# EAGLE design SimpleCART (EAGLE 9.6.2)
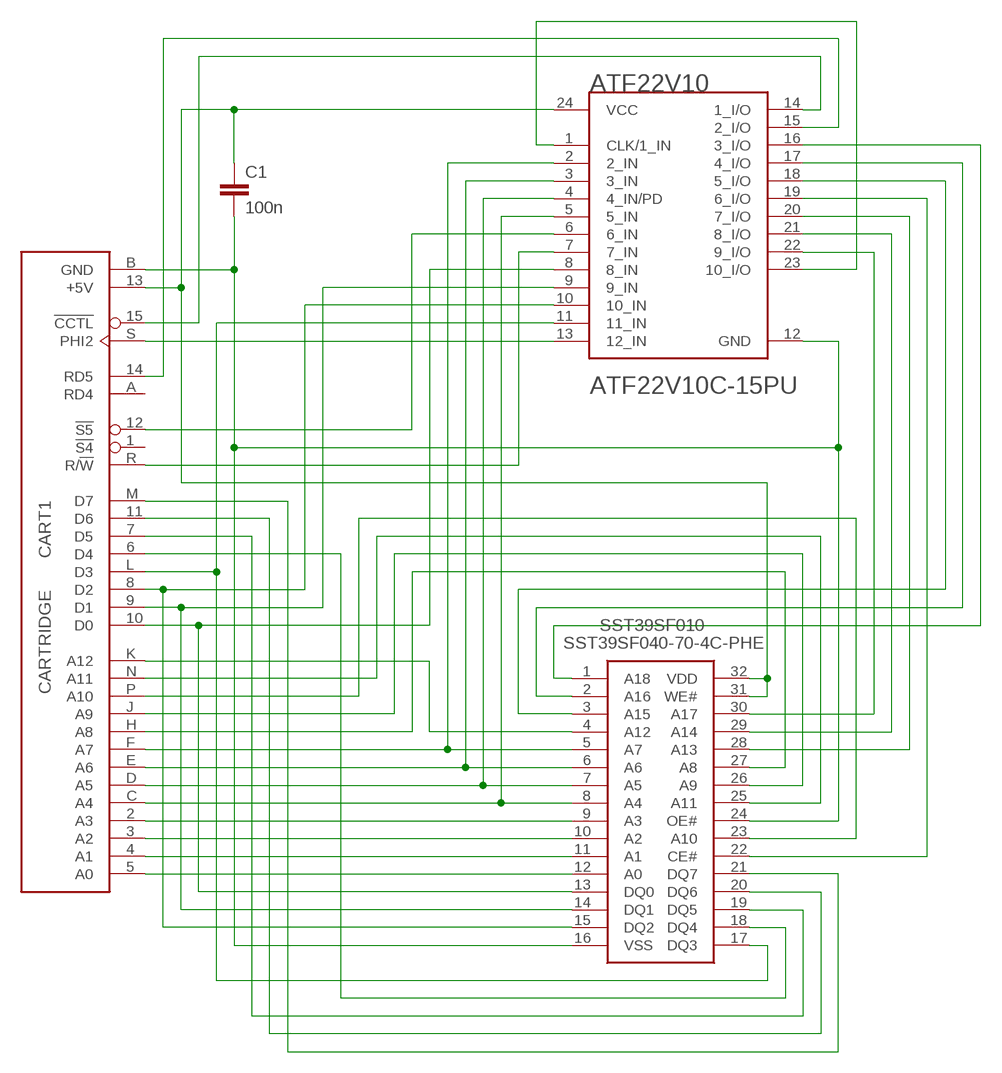
[diagram p0: schematic, sheet 1]

## Parts
ATF22V10  MICROCHIP_ATF22V10C-15PUMICROCHIP_ATF22V10C-15PU_0_0  [MICROCHIP_ATF22V10C-15PU_0]
C1  100n  C-EU025-024X044  [C025-024X044]
CART1  CARTRIDGE  [CARTRIDGE]
SST39SF010  SST39SF040-70-4C-PHE  [DIP1556W56P254L4191H508Q32N]

## Nets
A0: CART1.5(A0) SST39SF010.12(A0)
A1: CART1.4(A1) SST39SF010.11(A1)
A2: CART1.3(A2) SST39SF010.10(A2)
A3: CART1.2(A3) SST39SF010.9(A3)
A4: ATF22V10.5(5_IN) CART1.C(A4) SST39SF010.8(A4)
A5: ATF22V10.4(4_IN/PD) CART1.D(A5) SST39SF010.7(A5)
A6: ATF22V10.3(3_IN) CART1.E(A6) SST39SF010.6(A6)
A7: ATF22V10.2(2_IN) CART1.F(A7) SST39SF010.5(A7)
A8: CART1.H(A8) SST39SF010.27(A8)
A9: CART1.J(A9) SST39SF010.26(A9)
A10: CART1.P(A10) SST39SF010.23(A10)
A11: CART1.N(A11) SST39SF010.25(A11)
A12: CART1.K(A12) SST39SF010.4(A12)
A13: ATF22V10.20(7_I/O) SST39SF010.28(A13)
A14: ATF22V10.21(8_I/O) SST39SF010.29(A14)
A15: ATF22V10.18(5_I/O) SST39SF010.3(A15)
A16: ATF22V10.17(4_I/O) SST39SF010.2(A16)
A17: ATF22V10.22(9_I/O) SST39SF010.30(A17)
A18: ATF22V10.16(3_I/O) SST39SF010.1(A18)
CCTL: ATF22V10.14(1_I/O) CART1.15(!CCTL)
CE: ATF22V10.19(6_I/O) SST39SF010.22(CE#)
CLK: ATF22V10.1(CLK/1_IN) ATF22V10.23(10_I/O)
D0: ATF22V10.8(8_IN) CART1.10(D0) SST39SF010.13(DQ0)
D1: ATF22V10.9(9_IN) CART1.9(D1) SST39SF010.14(DQ1)
D2: ATF22V10.10(10_IN) CART1.8(D2) SST39SF010.15(DQ2)
D3: ATF22V10.11(11_IN) CART1.L(D3) SST39SF010.17(DQ3)
D4: CART1.6(D4) SST39SF010.18(DQ4)
D5: CART1.7(D5) SST39SF010.19(DQ5)
D6: CART1.11(D6) SST39SF010.20(DQ6)
D7: CART1.M(D7) SST39SF010.21(DQ7)
GND: ATF22V10.12(GND) C1.2 CART1.B(GND) SST39SF010.16(VSS) SST39SF010.24(OE#)
PHI2: ATF22V10.13(12_IN) CART1.S(PHI2)
RD5: ATF22V10.15(2_I/O) CART1.14(RD5)
RW: ATF22V10.7(7_IN) CART1.R(R/!W)
S5: ATF22V10.6(6_IN) CART1.12(!S5)
VCC: ATF22V10.24(VCC) C1.1 CART1.13(+5V) SST39SF010.31(WE#) SST39SF010.32(VDD)
Unconnected: CART1.1(!S4) CART1.A(RD4)

## Library data of the parts
ATF22V10 = Microchip - ATF22V10C-15PU:MICROCHIP_ATF22V10C-15PU: IC PLD 10MC 15NS 24DIP; AMBIENT_TEMPERATURE_RANGE_HIGH: +85°C; AMBIENT_TEMPERATURE_RANGE_LOW: -40°C; AUTOMOTIVE: No; CENTROID_NOT_SPECIFIED: No; DATASHEET: http://ww1.microchip.com/downloads/en/DeviceDoc/doc0735.pdf; DEVICE_CLASS_L1: Integrated Circuits (ICs); DEVICE_CLASS_L2: Embedded Processors and Controllers; DEVICE_CLASS_L3: CPLDs - Complex Programming Logic Devices; DIGIKEY_DESCRIPTION: IC PLD 10MC 15NS 24DIP; DIGIKEY_PART_NUMBER: ATF22V10C-15PU-ND; FOOTPRINT_PARAMETERS_0: {"fp_type":"DIP","params":{"N":{"nom":24,"long name":"Number of leads","min":null,"max":null,"short name":"N","type":"count"},"A":{"nom":false,"long name":"Height","min":false,"max":5334000,"short name":"A","type":"measurement"},"A1":{"nom":false,"long name":"Package clearance","min":381000,"max":false,"short name":"A1","type":"measurement"},"A2":{"nom":false,"long name":"Package height","min":false,"max":4952999,"short name":"A2","type":"measurement"},"D":{"nom":false,"long name":"Package length","min":false,"max":32131000,"short name":"D","type":"measurement"},"E":{"nom":false,"long name":"Width w/ leads","min":7620000,"max":8255000,"short name":"E","type":"measurement"},"E1":{"nom":false,"long name":"Package width","min":false,"max":7112000,"short name":"E1","type":"measurement"},"B":{"nom":false,"long name":"Lead width","min":356000,"max":559000,"short name":"B","type":"measurement"},"C":{"nom":false,"long name":"Lead thickness","min":203000,"max":356000,"short name":"C","type":"measurement"},"e":{"nom":2540000,"long name":"Lead pitch","min":null,"max":null,"short name":"e","type":"measurement"},"offset x":{"nom":0,"long name":"X Center offset","min":null,"max":null,"short name":"offset x","type":"measurement"},"offset y":{"nom":0,"long name":"Y Center offset","min":null,"max":null,"short name":"offset y","type":"measurement"},"LS":{"default":"Circle","long name":"Land shape","type":"multichoice","short name":"LS"},"LS1":{"default":"Square","long name":"Land shape (Pin 1)","type":"multichoice","short name":"LS1"}}}; FOOTPRINT_VARIANT_NAME_0: Recommended_Land_Pattern; FREQUENCY: 83.3MHz; HEIGHT: 5.334mm; IPC_LAND_PATTERN_NAME: DIP794W46P254L3213H533Q24; LEAD_FREE: Yes; MAX_SUPPLY_VOLTAGE: 5.5V; MEMORY_TYPE: FLASH,CMOS; MF: Microchip; MFG_PACKAGE_IDENT: 24P3; MFG_PACKAGE_IDENT_DATE: 06/2004; MFG_PACKAGE_IDENT_REV: D; MIN_SUPPLY_VOLTAGE: 4.5V; MOUSER_PART_NUMBER: 556-AF22V10C15PU; MPN: ATF22V10C-15PU; NOMINAL_SUPPLY_CURRENT: 65-70mA; NUMBER_OF_I/OS: 22; NUMBER_OF_MACROCELLS: 10; PACKAGE: PDIP24; PREFIX: U; PROPAGATION_DELAY: 15ns; ROHS: Yes; STANDOFF_HEIGHT: 0.381mm; TEMPERATURE_RANGE_HIGH: +85°C; TEMPERATURE_RANGE_LOW: -40°C; VERIFICATION_VERSION: 0.0.0.2
C1 = rcl:C-EU: CAPACITOR, European symbol; SPICEPREFIX: C
CART1 = Mq-Atari-cartridge-Sikor:CARTRIDGE: Cartridge
SST39SF010 = SST39SF040-70-4C-PHE:SST39SF040-70-4C-PHE: Microchip SST39SF040-70-4C-PHE, Parallel, Serial 4Mbit Flash Memory, 70ns; 5V, PDIP, 32-Pin Source: Datasheet <http://ww1.microchip.com/downloads/en/DeviceDoc/20005022C.pdf>; ARROW_PART_NUMBER: SST39SF040-70-4C-PHE; ARROW_PRICE-STOCK: https://www.arrow.com/en/products/sst39sf040-70-4c-phe/microchip-technology; DESCRIPTION: Microchip SST39SF040-70-4C-PHE, Parallel, Serial 4Mbit Flash Memory, 70ns; 5V, PDIP, 32-Pin; HEIGHT: 5.08mm; MANUFACTURER_NAME: Microchip; MANUFACTURER_PART_NUMBER: SST39SF040-70-4C-PHE; MOUSER_PART_NUMBER: 804-39SF0407CPHE; MOUSER_PRICE-STOCK: https://www.mouser.co.uk/ProductDetail/Microchip-Technology/SST39SF040-70-4C-PHE?qs=YClUa%252B2dcx1pgizrqJ6nyQ%3D%3D

## Board
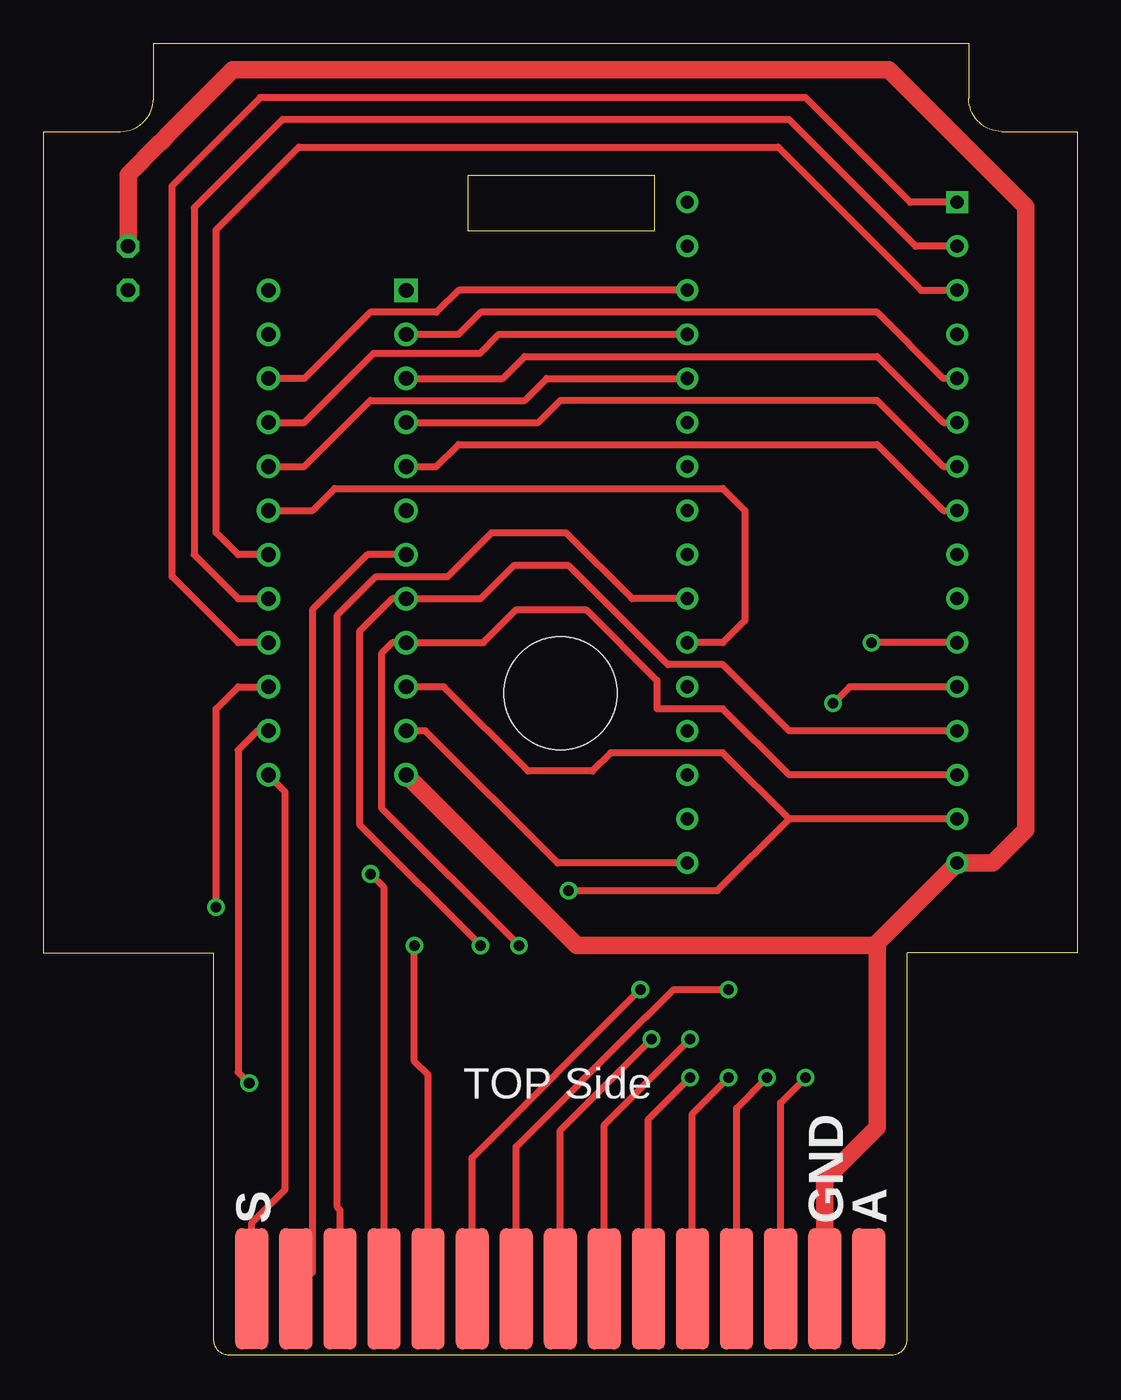
[diagram p1: board, top side]
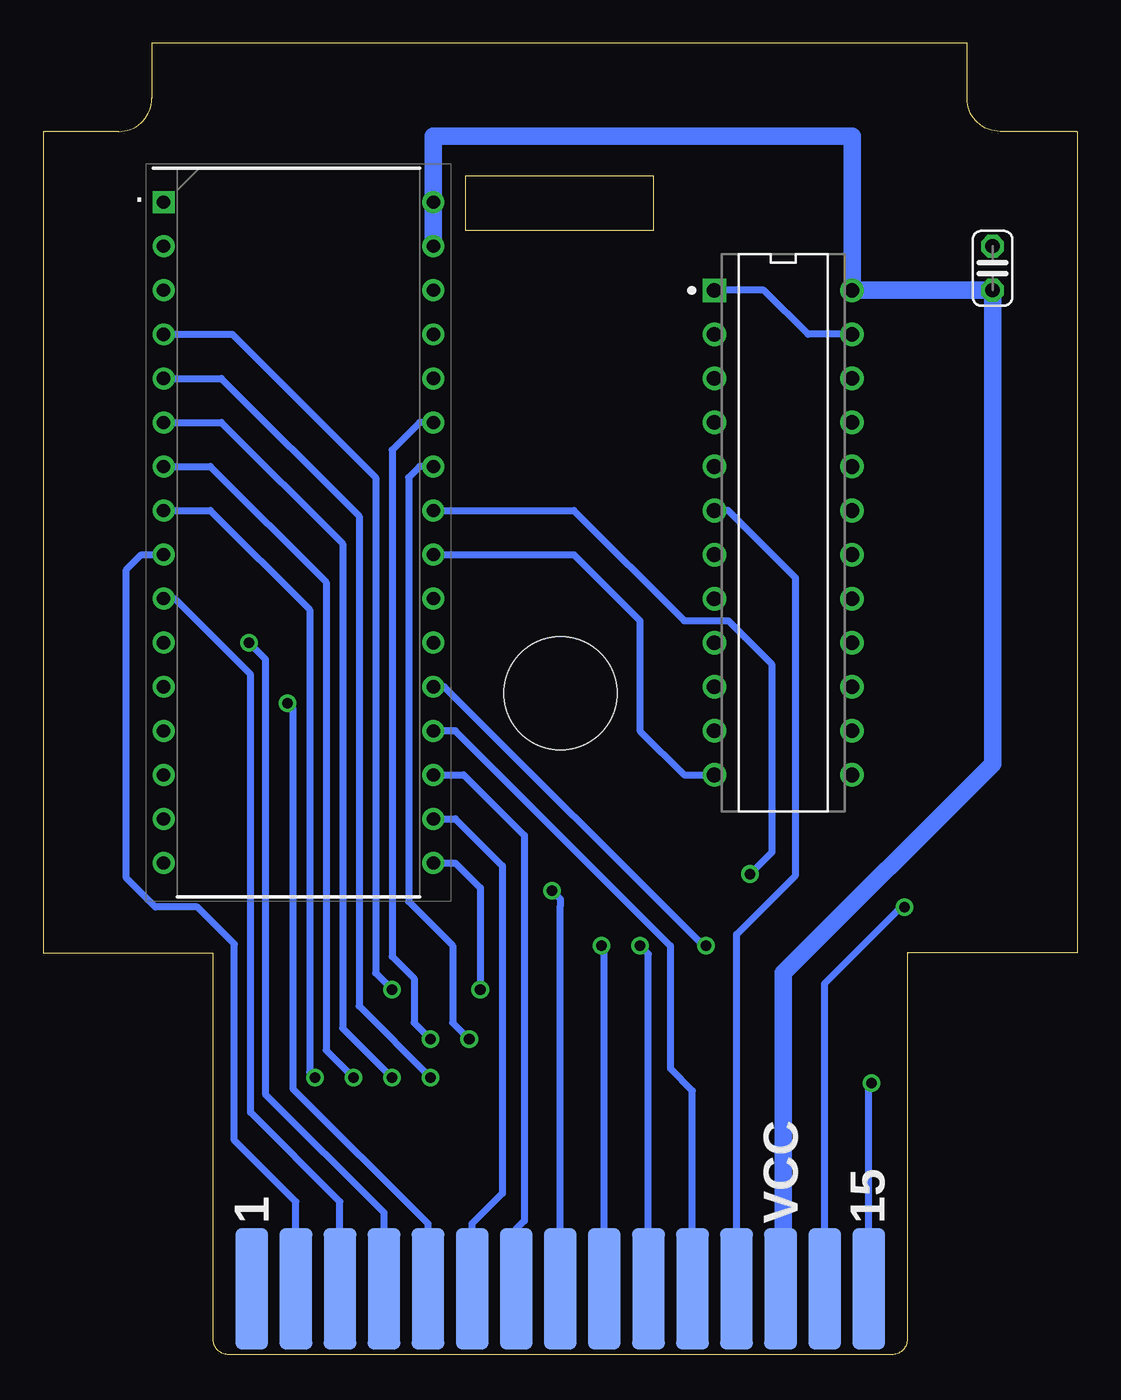
[diagram p2: board, bottom side, seen from below]

Size 59.59 x 75.62 mm. Coordinates in mm from the lower left corner, seen from the top.
Copper layers (1*16): Top 0.035mm / dielectric 1.5mm / Bottom 0.035mm
Design rules "default": minimum track width 10mil, minimum drill 24mil, track to track 8mil, track to pad 8mil, pad to pad 8mil, via to via 8mil, smd to smd 8mil, copper to edge 40mil, drill to drill 8mil, minimum pad ring 10mil, minimum via ring 8mil, stop-mask expansion 4mil, vias tented up to drill 0mil, thermal gap 10mil

### Footprints (pad centres in the part's own frame; a part is rotated, then mirrored left to right if it is on the bottom)
MICROCHIP_ATF22V10C-15PU_0 = drill 0.85 pad 1.35 square: 1 -3.969,13.97 | drill 0.85 pad 1.35: 2 -3.969,11.43; 3 -3.969,8.89; 4 -3.969,6.35; 5 -3.969,3.81; 6 -3.969,1.27; 7 -3.969,-1.27; 8 -3.969,-3.81; 9 -3.969,-6.35; 10 -3.969,-8.89; 11 -3.969,-11.43; 12 -3.969,-13.97; 13 3.969,-13.97; 14 3.969,-11.43; 15 3.969,-8.89; 16 3.969,-6.35; 17 3.969,-3.81; 18 3.969,-1.27; 19 3.969,1.27; 20 3.969,3.81; 21 3.969,6.35; 22 3.969,8.89; 23 3.969,11.43; 24 3.969,13.97
C025-024X044 = drill 0.813 octagon: 1 -1.27,0; 2 1.27,0
CARTRIDGE = smd 1.9 x 7: 1 47.575,71.817; 2 45.035,71.817; 3 42.495,71.817; 4 39.955,71.817; 5 37.415,71.817; 6 34.875,71.817; 7 32.335,71.817; 8 29.795,71.817; 9 27.255,71.817; 10 24.715,71.817; 11 22.175,71.817; 12 19.635,71.817; 13 17.095,71.817; 14 14.555,71.817; 15 12.015,71.817 | smd 1.9 x 7 bottom: A 47.575,71.817; B 45.035,71.817; C 42.495,71.817; D 39.955,71.817; E 37.415,71.817; F 34.875,71.817; H 32.335,71.817; J 29.795,71.817; K 27.255,71.817; L 24.715,71.817; M 22.175,71.817; N 19.635,71.817; P 17.095,71.817; R 14.555,71.817; S 12.015,71.817 | hole 6.5: 29.795,37.487
DIP1556W56P254L4191H508Q32N = drill 0.758 pad 1.158 square: 1 -7.779,19.05 | drill 0.758 pad 1.158: 2 -7.779,16.51; 3 -7.779,13.97; 4 -7.779,11.43; 5 -7.779,8.89; 6 -7.779,6.35; 7 -7.779,3.81; 8 -7.779,1.27; 9 -7.779,-1.27; 10 -7.779,-3.81; 11 -7.779,-6.35; 12 -7.779,-8.89; 13 -7.779,-11.43; 14 -7.779,-13.97; 15 -7.779,-16.51; 16 -7.779,-19.05; 17 7.779,-19.05; 18 7.779,-16.51; 19 7.779,-13.97; 20 7.779,-11.43; 21 7.779,-8.89; 22 7.779,-6.35; 23 7.779,-3.81; 24 7.779,-1.27; 25 7.779,1.27; 26 7.779,3.81; 27 7.779,6.35; 28 7.779,8.89; 29 7.779,11.43; 30 7.779,13.97; 31 7.779,16.51; 32 7.779,19.05

### Placement (x,y rotation side)
ATF22V10  16.95,47.41 0 bottom
C1  4.88,62.65 90 bottom
CART1  0,75.62 180 bottom
SST39SF010  44.88,47.41 0 bottom

### Tracks (layer width: path | path; a pad name or v marks a point on that pad's centre or on a via)
A0  (via drill 0.61)
  Top 0.406: v45.52,37.56 46.47,38.52 SST39SF010.12
  Bottom 0.406: CART1.5 37.41,7.55 45.2,15.34 45.2,37.25 v45.52,37.56
A1  (via drill 0.61)
  Top 0.406: SST39SF010.11 v47.74,41.06
  Bottom 0.406: CART1.4 39.95,8.19 46.79,15.02 46.79,40.11 v47.74,41.06
A2
  Bottom 0.406: CART1.3 42.49,8.82 47.65,13.98 47.65,39.22 52.03,43.6 SST39SF010.10
A3
  Bottom 0.406: CART1.2 45.03,8.82 48.58,12.36 48.58,23.68 50.71,25.82 53.14,25.82 54.81,27.48 54.81,45.26 53.93,46.14 SST39SF010.9
A4  (via drill 0.61)
  Top 0.406: ATF22V10.5 22.66,51.22 23.93,52.49 48.06,52.49 51.87,48.68 SST39SF010.8 | v43.93,15.98 42.49,14.54 CART1.C
  Bottom 0.406: SST39SF010.8 49.96,48.68 44.25,42.96 44.25,16.29 v43.93,15.98
A5  (via drill 0.61)
  Top 0.406: CART1.D 39.95,14.22 v41.71,15.98 | ATF22V10.4 28.53,53.76 29.8,55.03 48.06,55.03 51.87,51.22 SST39SF010.7
  Bottom 0.406: SST39SF010.7 49.96,51.22 43.3,44.55 43.3,17.56 v41.71,15.98
A6  (via drill 0.61)
  Top 0.406: CART1.E 37.41,13.9 v39.49,15.98 | ATF22V10.3 26.47,56.3 27.74,57.57 48.06,57.57 51.87,53.76 SST39SF010.6
  Bottom 0.406: SST39SF010.6 49.33,53.76 42.34,46.77 42.34,18.83 v39.49,15.98
A7  (via drill 0.61)
  Top 0.406: 35.36,4.29 CART1.F 34.88,13.59 v37.27,15.98 | ATF22V10.2 23.93,58.84 25.2,60.11 48.06,60.11 51.87,56.3 SST39SF010.5
  Bottom 0.406: SST39SF010.5 49.33,56.3 41.39,48.36 41.39,20.1 v37.27,15.98
A8  (via drill 0.61)
  Top 0.406: 32.82,4.29 CART1.H 32.33,13.27 v37.27,18.2
  Bottom 0.406: SST39SF010.27 37.9,53.76 39.49,52.17 39.49,22.96 38.22,21.69 38.22,19.15 v37.27,18.2
A9  (via drill 0.61)
  Top 0.406: 30.28,4.29 CART1.J 29.8,12.95 v35.04,18.2
  Bottom 0.406: SST39SF010.26 37.9,51.22 38.53,50.58 38.53,26.14 35.99,23.6 35.99,19.15 v35.04,18.2
A10
  Top 0.406: SST39SF010.23 33.93,43.6 30.12,47.41 25.84,47.41 23.3,44.87 19.17,44.87 16.95,42.65 16.95,8.5 17.1,8.35 CART1.P
A11  (via drill 0.61)
  Top 0.406: CART1.N 19.64,26.94 v18.85,27.72
  Bottom 0.406: SST39SF010.25 29.01,48.68 22.66,42.33 20.12,42.33 17.58,39.79 17.58,28.99 v18.85,27.72
A12  (via drill 0.61)
  Top 0.406: CART1.K 27.25,12 34.76,19.51 34.79,19.51 36.34,21.05 v39.49,21.05
  Bottom 0.406: SST39SF010.4 48.7,58.84 40.44,50.58 40.44,22.01 v39.49,21.05
A13
  Top 0.406: ATF22V10.20 15.04,51.22 18.85,55.03 27.74,55.03 29.01,56.3 SST39SF010.28
A14
  Top 0.406: ATF22V10.21 15.04,53.76 19.04,57.75 25.17,57.75 26.26,58.84 SST39SF010.29
A15
  Top 0.406: ATF22V10.18 11.23,46.14 9.96,47.41 9.96,64.87 14.72,69.63 42.34,69.63 50.6,61.38 SST39SF010.3
A16
  Top 0.406: SST39SF010.2 50.28,63.92 42.98,71.22 13.77,71.22 8.69,66.14 8.69,46.14 11.23,43.6 ATF22V10.17
A17
  Top 0.406: SST39SF010.30 23.93,61.38 22.66,60.11 18.85,60.11 15.04,56.3 ATF22V10.22
A18
  Top 0.406: SST39SF010.1 49.96,66.46 43.93,72.49 12.5,72.49 7.42,67.41 7.42,44.87 11.23,41.06 ATF22V10.16
CCTL  (via drill 0.61)
  Top 0.406: ATF22V10.14 12.34,35.98 11.23,34.87 11.23,16.29 v11.87,15.66
  Bottom 0.406: CART1.15 12.02,15.51 v11.87,15.66
CE
  Top 0.406: SST39SF010.22 39.17,41.06 40.44,42.33 40.44,48.68 39.17,49.95 16.79,49.95 15.52,48.68 ATF22V10.19
CLK
  Bottom 0.406: ATF22V10.23 15.52,58.84 18.06,61.38 ATF22V10.1
D0  (via drill 0.61)
  Top 0.406: SST39SF010.13 42.98,35.98 39.17,39.79 35.99,39.79 30.28,45.5 27.11,45.5 25.2,43.6 ATF22V10.8 20.12,43.6 18.21,41.69 18.21,30.58 v25.2,23.6
  Bottom 0.406: 24.63,3.89 CART1.10 24.71,23.11 v25.2,23.6
D1  (via drill 0.61)
  Top 0.406: SST39SF010.14 42.98,33.44 39.17,37.25 35.36,37.25 35.36,38.89 31.28,42.96 27.26,42.96 25.36,41.06 ATF22V10.9 20.12,41.06 19.48,40.42 19.48,31.53 v27.42,23.6
  Bottom 0.406: v27.42,23.6 27.25,23.43 CART1.9
D2  (via drill 0.61)
  Top 0.406: SST39SF010.15 42.98,30.9 | 42.98,30.9 39.17,34.71 32.69,34.71 31.65,33.66 27.94,33.66 23.09,38.52 ATF22V10.10 | v30.28,26.77 38.85,26.77 42.98,30.9
  Bottom 0.406: 30.28,4.29 CART1.8 29.8,25.89 29.77,25.91 29.77,26.26 v30.28,26.77
D3  (via drill 0.61)
  Top 0.406: CART1.L 24.71,11.36 v34.41,21.05 | ATF22V10.11 22.03,35.98 29.64,28.36 SST39SF010.17
  Bottom 0.406: SST39SF010.17 35.84,28.36 34.41,26.93 v34.41,21.05
D4
  Bottom 0.406: 34.79,3.89 CART1.6 34.88,7.57 33.14,9.31 33.14,28.2 35.84,30.9 SST39SF010.18
D5
  Bottom 0.406: SST39SF010.19 35.36,33.44 31.87,29.94 31.87,7.72 32.33,7.25 CART1.7
D6
  Bottom 0.406: CART1.11 22.18,15.23 23.45,16.5 23.45,23.59 35.84,35.98 SST39SF010.20
D7  (via drill 0.61)
  Top 0.406: CART1.M 22.18,16.14 21.39,16.93 v21.39,23.6
  Bottom 0.406: v21.39,23.6 21.55,23.6 36.47,38.52 SST39SF010.21
GND
  Top 1.016: 48.06,23.6 48.06,13.12 45.03,10.09 CART1.B | ATF22V10.12 30.76,23.6 48.06,23.6 | 48.06,23.6 48.06,23.75 SST39SF010.16 54.73,28.36 56.63,30.26 56.63,66.19 48.73,74.09 10.91,74.09 7.15,70.33 6.88,70.01 6.66,69.82 4.88,68.04 C1.2
  Bottom 0.406: SST39SF010.24 29.01,46.14 25.2,42.33 25.2,35.98 22.66,33.44 ATF22V10.12
PHI2
  Top 0.406: CART1.S 12.02,7.61 13.92,9.51 13.92,32.48 12.98,33.42 ATF22V10.13
RD5  (via drill 0.61)
  Top 0.406: ATF22V10.15 11.23,38.52 9.96,37.25 v9.96,25.82
  Bottom 0.406: CART1.14 14.56,21.41 10.15,25.82 v9.96,25.82
RW
  Top 0.406: CART1.R 15.51,4.75 15.51,42.96 18.68,46.14 ATF22V10.7
S5
  Bottom 0.406: CART1.12 19.64,24.24 16.23,27.64 16.23,44.79 20.12,48.68 ATF22V10.6
VCC
  Bottom 1.016: CART1.13 16.95,3.8 16.95,22.01 4.88,34.07 C1.1 ATF22V10.24 12.98,70.27 37.11,70.27 SST39SF010.32 SST39SF010.31

### Text on the board
tNames: TOP Side
bNames: .